# EAGLE design Qwiic_GPIO (EAGLE 9.4.2)
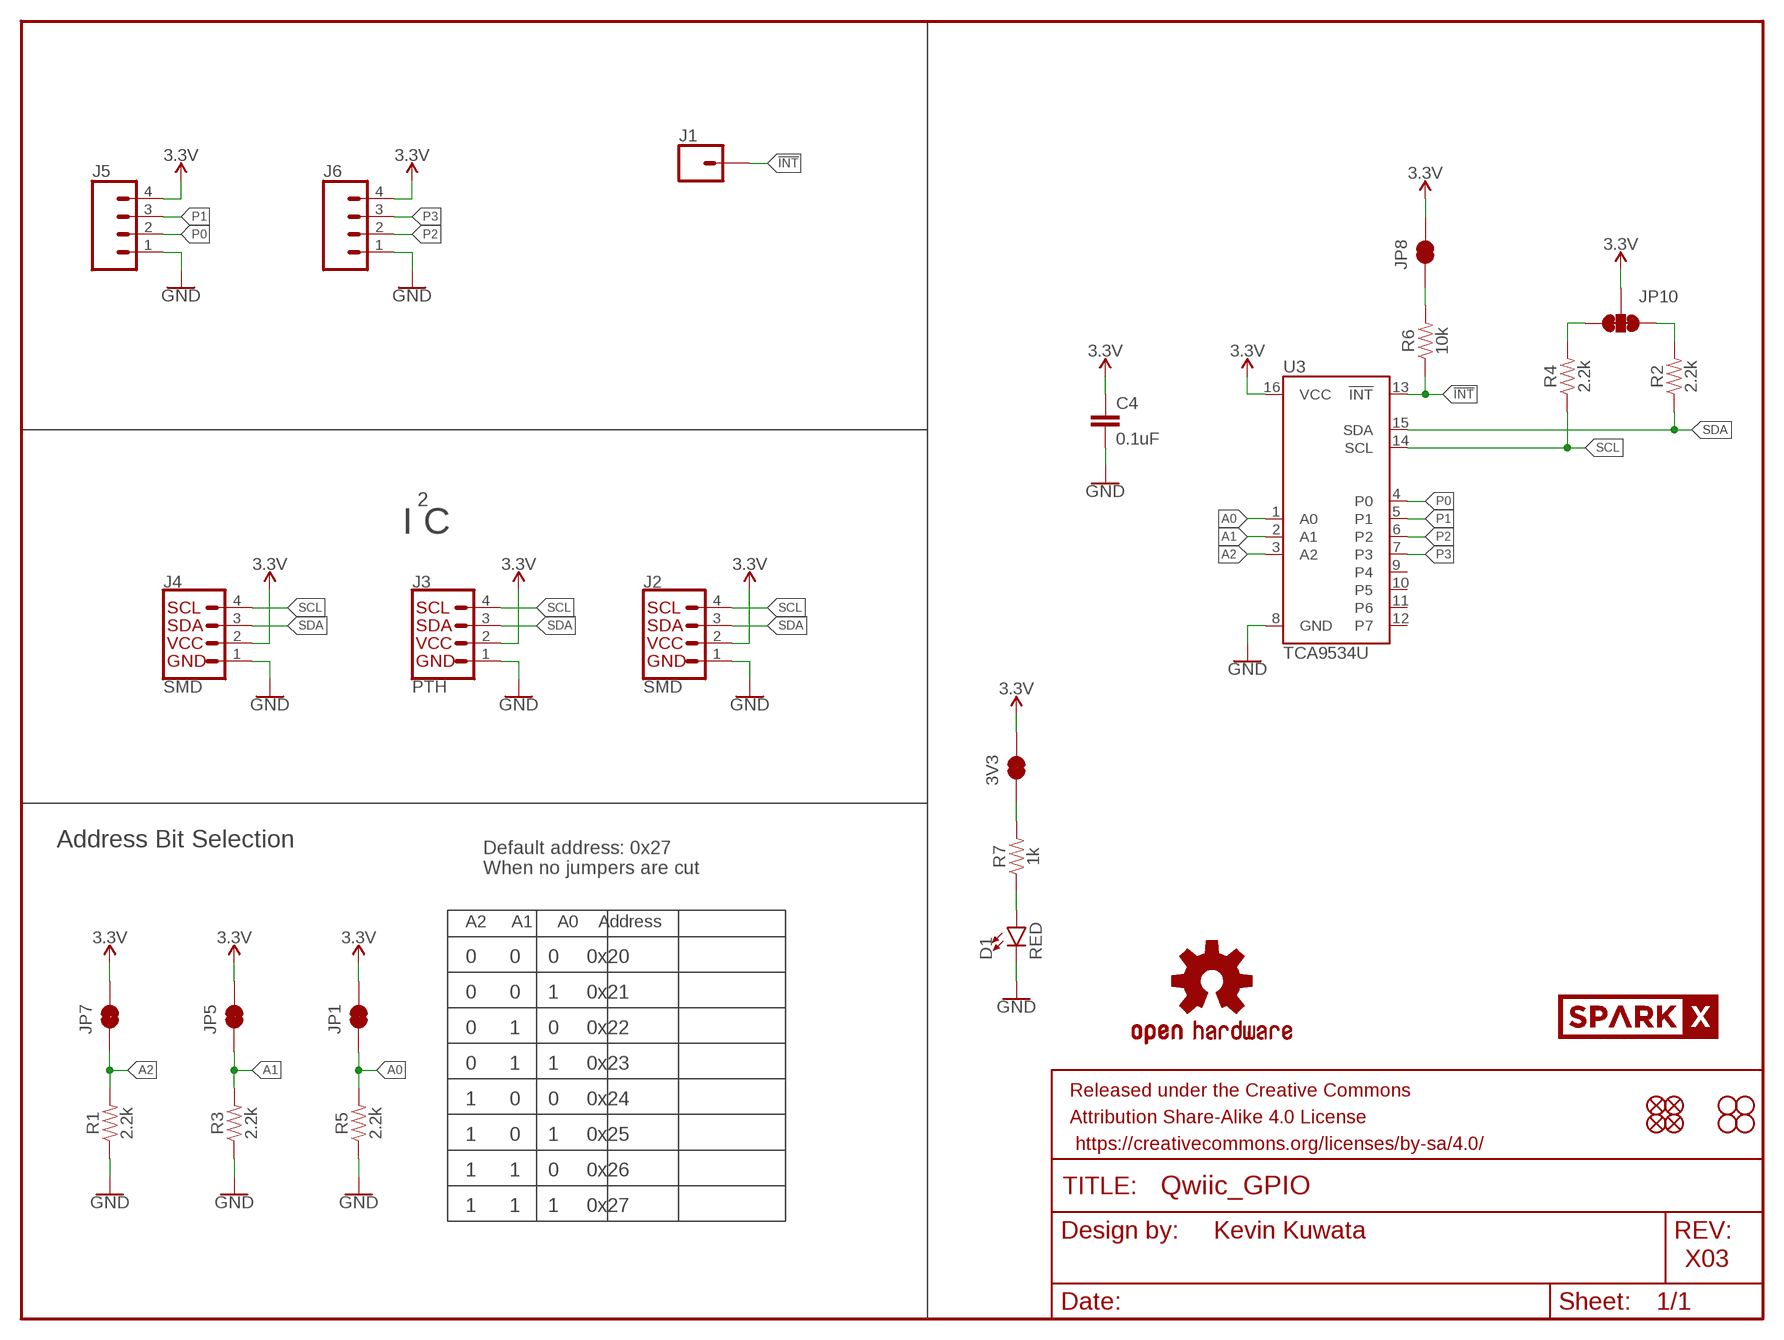
[diagram p0: schematic, sheet 1]

## Parts
3V3  JUMPER-SMT_2_NC_TRACE_SILK  [SMT-JUMPER_2_NC_TRACE_SILK]
C4  0.1uF  0.1UF-0603-25V-(+80/-20%)  [0603]
D1  RED  LED-RED0603  [LED-0603]
FD1  FIDUCIAL1X2  [FIDUCIAL-1X2]
FD2  FIDUCIAL1X2  [FIDUCIAL-1X2]
FRAME1  FRAME-LETTER  [CREATIVE_COMMONS]
H1  STAND-OFF  [STAND-OFF]
H2  STAND-OFF  [STAND-OFF]
J1  CONN_01PTH_NO_SILK_YES_STOP  [1X01_NO_SILK]
J2  SMD  I2C_STANDARDJS-1MM  [1X04_1MM_RA]
J3  PTH  I2C_STANDARD_NO_SILK  [1X04_NO_SILK]
J4  SMD  I2C_STANDARDJS-1MM  [1X04_1MM_RA]
J5  CONN_04LATCH  [LATCHTERMINAL-5MM-4]
J6  CONN_04LATCH  [LATCHTERMINAL-5MM-4]
JP1  JUMPER-SMT_2_NC_TRACE_SILK  [SMT-JUMPER_2_NC_TRACE_SILK]
JP2  FIDUCIAL1X2  [FIDUCIAL-1X2]
JP3  STAND-OFF  [STAND-OFF]
JP4  STAND-OFF  [STAND-OFF]
JP5  JUMPER-SMT_2_NC_TRACE_SILK  [SMT-JUMPER_2_NC_TRACE_SILK]
JP6  FIDUCIAL1X2  [FIDUCIAL-1X2]
JP7  JUMPER-SMT_2_NC_TRACE_SILK  [SMT-JUMPER_2_NC_TRACE_SILK]
JP8  JUMPER-SMT_2_NC_TRACE_SILK  [SMT-JUMPER_2_NC_TRACE_SILK]
JP10  JUMPER-SMT_3_2-NC_TRACE_SILK  [SMT-JUMPER_3_2-NC_TRACE_SILK]
LOGO1  OSHW-LOGOMINI  [OSHW-LOGO-MINI]
R1  2.2k  2.2KOHM-0603-1/10W-1%  [0603]
R2  2.2k  2.2KOHM-0603-1/10W-1%  [0603]
R3  2.2k  2.2KOHM-0603-1/10W-1%  [0603]
R4  2.2k  2.2KOHM-0603-1/10W-1%  [0603]
R5  2.2k  2.2KOHM-0603-1/10W-1%  [0603]
R6  10k  10KOHM-0603-1/10W-1%  [0603]
R7  1k  1KOHM-0603-1/10W-1%  [0603]
U3  TCA9534U  [16SOIC]
U$1  SPARKX-LOGO3  [SPARKX-SMALL]
U$2  SPARKX-LOGO3  [SPARKX-SMALL]

## Nets
3.3V: 3V3.2 C4.1 J2.2(VCC) J3.2(VCC) J4.2(VCC) J5.4 J6.4 JP1.2 JP5.2 JP7.2 JP8.2 JP10.2 U3.16(VCC)
!INT: J1.1 R6.1 U3.13(!INT)
A0: JP1.1 R5.2 U3.1(A0)
A1: JP5.1 R3.2 U3.2(A1)
A2: JP7.1 R1.2 U3.3(A2)
GND: C4.2 D1.C J2.1(GND) J3.1(GND) J4.1(GND) J5.1 J6.1 R1.1 R3.1 R5.1 U3.8(GND)
N$1: JP8.1 R6.2
N$2: D1.A R7.1
N$3: 3V3.1 R7.2
P0: J5.2 U3.4(P0)
P1: J5.3 U3.5(P1)
P2: J6.2 U3.6(P2)
P3: J6.3 U3.7(P3)
SCL: J2.4(SCL) J3.4(SCL) J4.4(SCL) R4.1 U3.14(SCL)
SCL_PU1: JP10.1 R2.2
SDA: J2.3(SDA) J3.3(SDA) J4.3(SDA) R2.1 U3.15(SDA)
SDA_PU1: JP10.3 R4.2
Unconnected: U3.9(P4) U3.10(P5) U3.11(P6) U3.12(P7)

## Notes on the sheet
- 2
- I C
- Address Bit Selection
- Default address: 0x27
  When no jumpers are cut
- A2     A1     A0    Address
- 0      0     0     0x20
- 0      0     1     0x21
- 0      1     0     0x22
- 0      1     1     0x23
- 1      0     0     0x24
- 1      0     1     0x25
- 1      1     0     0x26
- 1      1     1     0x27
- Kevin Kuwata
- X03

## Library data of the parts
3V3 JP1 JP5 JP7 JP8 = SparkFun-Jumpers:JUMPER-SMT_2_NC_TRACE: Normally closed trace jumper This jumper has a trace between two pads so it's normally closed (NC). Use a razor knife to open the connection. For best results follow the IPC guidelines for cutting traces: Cutout at least 0.063 mm (0.005 in). Remove all loose material to clean up the cut area. Seal the cut with an approved epoxy. Reapply solder to reclose the connection.
C4 = SparkFun-Capacitors:0.1UF: 0.1µF ceramic capacitors A capacitor is a passive two-terminal electrical component used to store electrical energy temporarily in an electric field.; PROD_ID: CAP-00810
D1 = SparkFun-LED:LED-RED: Red SMD LED Used in manufacturing of most products at SparkFun Packages: 0603 - SMD 0603 package [Product Link] <http://docs.avagotech.com/docs/AV02-0551EN> 0603 SMART - SMD 0603 SMART package ( more efficient and expensive)[Product Link] <http://www.osram-os.com/Graphics/XPic2/00077099_0.pdf> 1206 - SMD1206 package [Product Link] <https://www.sparkfun.com/datasheets/DevTools/LilyPad/Q150OVS4.pdff> SparkFun Products: Pro Mini 328 -5V <https://www.sparkfun.com/products/821> RedBoard <https://www.sparkfun.com/products/12757> IOIO-OTG <https://www.sparkfun.com/products/13613>; PROD_ID: DIO-00819
FD1 FD2 = SparkFun-Aesthetics:FIDUCIAL: Fiducial Alignment Points
FRAME1 = SparkFun-Aesthetics:FRAME-LETTER: Schematic Frame - Letter Standard 8.5x11 US Letter frame
H1 H2 = SparkFun-Hardware:STAND-OFF: Stand Off
J1 = SparkFun-Connectors:CONN_01: Single connection point. Often used as Generic Header-pin footprint for 0.1 inch spaced/style header connections On any of the 0.1 inch spaced packages, you can populate with these: Break Away Headers - Straight <https://www.sparkfun.com/products/116> (PRT-00116) Break Away Male Headers - Right Angle <https://www.sparkfun.com/products/553> (PRT-00553) Female Headers <https://www.sparkfun.com/products/115> (PRT-00115) Break Away Headers - Machine Pin <https://www.sparkfun.com/products/117> (PRT-00117) Break Away Female Headers - Swiss Machine Pin <https://www.sparkfun.com/products/743> (PRT-00743) This device is also useful as a general connection point to wire up your design to another part of your project. Our various solder wires solder well into these plated through hole pads. Hook-Up Wire - Assortment (Stranded, 22 AWG) <https://www.sparkfun.com/products/11375> (PRT-11375) Hook-Up Wire - Assortment (Solid Core, 22 AWG) <https://www.sparkfun.com/products/11367> (PRT-11367) View the entire wire category on our website here <https://www.sparkfun.com/categories/141> Special notes: SMTSO-256-ET is a "flush mount" nut for a 4-40 screw. We mostly use this on specialty testbeds; it is a nice way to connect hardware to your PCB at an adjustable hieght. Also note, the SNAP packages are for using a snappable style connector. We sell a baggie of snaps and they are also used on two LilyPad designs: Snap Assortment - 30 pack (male and female) <https://www.sparkfun.com/products/11347> (DEV-11347) LilyPad Arduino SimpleSnap <https://www.sparkfun.com/products/10941> (DEV-10941) LilyPad SimpleSnap Protoboard <https://www.sparkfun.com/products/10940> (DEV-10940)
J2 J4 = SparkX:I2C_STANDARD: SparkFun I2C Standard Pinout Header SparkFun has standardized on a pinout for all I2C based sensor breakouts. This pinout allows I2C boards to be plugged directly into the headers on Arduino Uno compatible boards, and to be daisy chained easily. Example SparkFun Products: SparkFun Atmospheric Sensor Breakout - BME280 <https://www.sparkfun.com/products/13676> SparkFun Altitude/Pressure Sensor Breakout - MPL3115A2 <https://www.sparkfun.com/products/11084> SparkFun TOF Range Finder Sensor - VL6180 <https://www.sparkfun.com/products/12785>; PROD_ID: CONN-13694
J3 = SparkX:I2C_STANDARD: SparkFun I2C Standard Pinout Header SparkFun has standardized on a pinout for all I2C based sensor breakouts. This pinout allows I2C boards to be plugged directly into the headers on Arduino Uno compatible boards, and to be daisy chained easily. Example SparkFun Products: SparkFun Atmospheric Sensor Breakout - BME280 <https://www.sparkfun.com/products/13676> SparkFun Altitude/Pressure Sensor Breakout - MPL3115A2 <https://www.sparkfun.com/products/11084> SparkFun TOF Range Finder Sensor - VL6180 <https://www.sparkfun.com/products/12785>
J5 J6 = SparkFun-Connectors:CONN_04: Multi connection point. Often used as Generic Header-pin footprint for 0.1 inch spaced/style header connections On any of the 0.1 inch spaced packages, you can populate with these: Break Away Headers - Straight <https://www.sparkfun.com/products/116> (PRT-00116) Break Away Male Headers - Right Angle <https://www.sparkfun.com/products/553> (PRT-00553) Female Headers <https://www.sparkfun.com/products/115> (PRT-00115) Break Away Headers - Machine Pin <https://www.sparkfun.com/products/117> (PRT-00117) Break Away Female Headers - Swiss Machine Pin <https://www.sparkfun.com/products/743> (PRT-00743) For SCREWTERMINALS and SPRING TERMINALS visit here: Screw Terimnals on SparkFun.com <https://www.sparkfun.com/search/results?term=Screw+Terminals> (5mm/3.5mm/2.54mm spacing) This device is also useful as a general connection point to wire up your design to another part of your project. Our various solder wires solder well into these plated through hole pads. Hook-Up Wire - Assortment (Stranded, 22 AWG) <https://www.sparkfun.com/products/11375> (PRT-11375) Hook-Up Wire - Assortment (Solid Core, 22 AWG) <https://www.sparkfun.com/products/11367> (PRT-11367) View the entire wire category on our website here <https://www.sparkfun.com/categories/141> Special notes: Molex polarized connector foot print use with SKU : PRT-08231 with associated crimp pins and housings. 1MM SMD Version SKU: PRT-10208; PROD_ID: CON-14722
JP2 JP6 = SparkFun:FIDUCIAL: Fiducial Alignment Points
JP3 JP4 = SparkFun:STAND-OFF: Stand Off
JP10 = SparkFun-Jumpers:JUMPER-SMT_3_2-NC_TRACE: Normally closed trace jumper (2 of 2 connections) This jumper has a trace between all three pads so they are normally closed (NC). Use a razor knife to open the connection(s). For best results follow the IPC guidelines for cutting traces: Cutout at least 0.063 mm (0.005 in). Remove all loose material to clean up the cut area. Seal the cut with an approved epoxy. Reapply solder to reclose the connection(s).
LOGO1 = SparkFun-Aesthetics:OSHW-LOGO: Open-Source Hardware (OSHW) Logo This logo indicates the piece of hardware it is found on incorporates a OSHW license and/or adheres to the definition of open source hardware found here: http://freedomdefined.org/OSHW
R1-R5 = SparkFun-Resistors:2.2KOHM: 2.2kΩ resistor A resistor is a passive two-terminal electrical component that implements electrical resistance as a circuit element. Resistors act to reduce current flow, and, at the same time, act to lower voltage levels within circuits. - Wikipedia; PROD_ID: RES-08272
R6 = SparkFun-Resistors:10KOHM: 10kΩ resistor A resistor is a passive two-terminal electrical component that implements electrical resistance as a circuit element. Resistors act to reduce current flow, and, at the same time, act to lower voltage levels within circuits. - Wikipedia; PROD_ID: RES-00824
R7 = SparkFun-Resistors:1KOHM: 1kΩ resistor A resistor is a passive two-terminal electrical component that implements electrical resistance as a circuit element. Resistors act to reduce current flow, and, at the same time, act to lower voltage levels within circuits. - Wikipedia; PROD_ID: RES-07856
U3 = KevinKuwata_eagle:TCA9534
U$1 U$2 = SparkX:SPARKX-LOGO

## Board
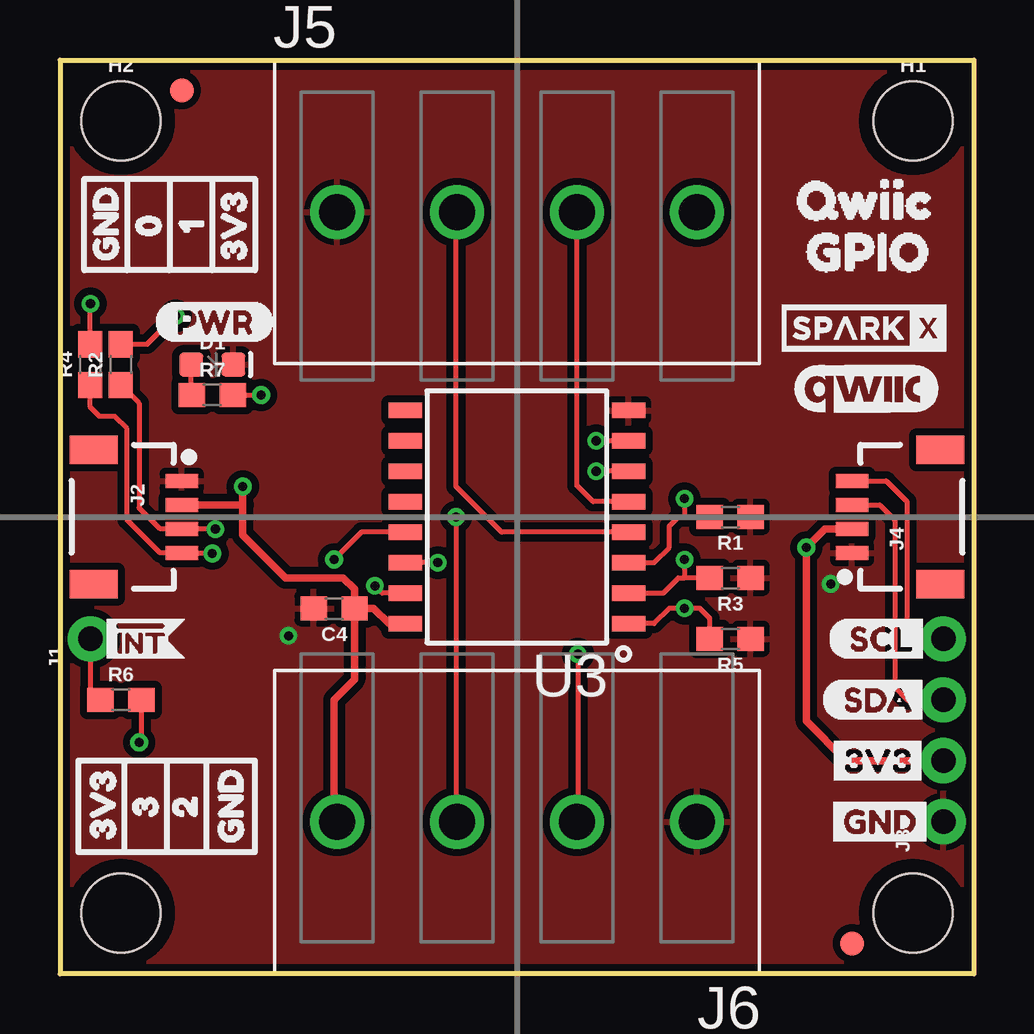
[diagram p1: board, top side]
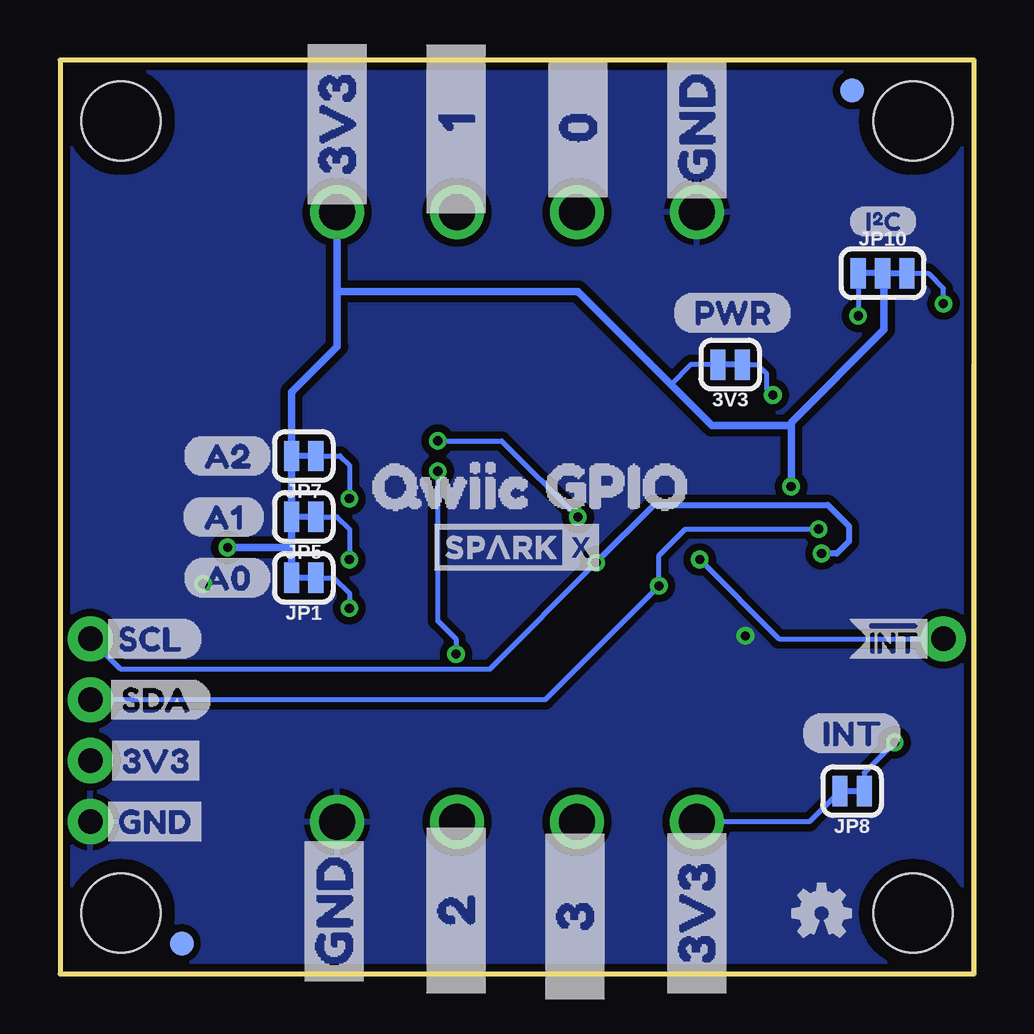
[diagram p2: board, bottom side, seen from below]

Size 38.1 x 38.1 mm. Coordinates in mm from the lower left corner, seen from the top.
Outline: 0,38.1 38.1,38.1 38.1,0 0,0 0,38.1
Copper layers (1*16): Top 0.035mm / dielectric 1.5mm / Bottom 0.035mm
Design rules "SparkFun-2-layer-PCBWay-LIMIT": minimum track width 6mil, minimum drill 12mil, track to track 6mil, track to pad 6mil, pad to pad 6mil, via to via 6mil, smd to smd 6mil, copper to edge 6mil, drill to drill 6mil, minimum pad ring 7mil, minimum via ring 7mil, stop-mask expansion 4mil, vias tented up to drill 25mil, thermal gap 10mil

### Footprints (pad centres in the part's own frame; a part is rotated, then mirrored left to right if it is on the bottom)
SMT-JUMPER_2_NC_TRACE_SILK = smd 0.635 x 1.27: 1 -0.508,0; 2 0.508,0
0603 = smd 1.1 x 1: 1 -0.85,0; 2 0.85,0
LED-0603 = smd 1 x 1: A -0.877,0; C 0.877,0
FIDUCIAL-1X2 = smd 1 x 1: 1 0,0
STAND-OFF = hole 3.302: 0,0
1X01_NO_SILK = drill 1.016 pad 1.88: 1 0,0
1X04_1MM_RA = smd 0.6 x 1.35: 1 -1.5,0; 2 -0.5,0; 3 0.5,0; 4 1.5,0 | smd 1.2 x 2: NC1 2.8,-3.675; NC2 -2.8,-3.675
1X04_NO_SILK = drill 1.016 pad 1.88: 1 0,0; 2 2.54,0; 3 5.08,0; 4 7.62,0
LATCHTERMINAL-5MM-4 = drill 1.5: 1 -7.5,0; 2 -2.5,0; 3 2.5,0; 4 7.5,0
SMT-JUMPER_3_2-NC_TRACE_SILK = smd 0.635 x 1.27: 1 -1.016,0; 2 0,0; 3 1.016,0
16SOIC = smd 1.397 x 0.648: 1 -4.65,4.445; 2 -4.65,3.175; 3 -4.65,1.905; 4 -4.65,0.635; 5 -4.65,-0.635; 6 -4.65,-1.905; 7 -4.65,-3.175; 8 -4.65,-4.445; 9 4.65,-4.445; 10 4.65,-3.175; 11 4.65,-1.905; 12 4.65,-0.635; 13 4.65,0.635; 14 4.65,1.905; 15 4.65,3.175; 16 4.65,4.445

### Placement (x,y rotation side)
3V3  10.16,25.4 180 bottom
C4  11.43,15.24 180 top
D1  6.35,25.4 0 top
FD1  5.08,36.83 0 bottom
FD2  33.02,1.27 270 bottom
FRAME1  -16.51,-49.53 0 top  (outside the outline)
H1  35.56,35.56 0 top
H2  2.54,35.56 0 top
J1  1.27,13.97 90 top
J2  5.08,19.05 270 top
J3  36.83,6.35 90 top
J4  33.02,19.05 90 top
J5  19.05,31.75 0 top
J6  19.05,6.35 180 top
JP1  27.94,16.51 180 bottom
JP2  33.02,1.27 0 top
JP3  2.54,2.54 0 top
JP4  35.56,2.54 0 top
JP5  27.94,19.05 180 bottom
JP6  5.08,36.83 0 top
JP7  27.94,21.59 180 bottom
JP8  5.08,7.62 180 bottom
JP10  3.81,29.21 0 bottom
LOGO1  6.35,2.54 0 bottom
R1  27.94,19.05 180 top
R2  2.54,25.4 90 top
R3  27.94,16.51 180 top
R4  1.27,25.4 90 top
R5  27.94,13.97 180 top
R6  2.54,11.43 0 top
R7  6.35,24.13 0 top
U3  19.05,19.05 180 top
U$1  19.05,17.78 0 bottom
U$2  33.53,26.92 0 top
U$3  [3V33]  31.75,8.89 0 top
U$5  [A11]  33.02,19.05 0 bottom
U$7  [GND4]  31.75,6.35 0 top
U$8  [QWIIC_GPIO7]  26.67,20.32 0 bottom
U$9  [SCL6]  32,13.97 0 top
U$10  [SDA5]  31.75,11.43 0 top
U$11  [A00]  33.02,16.51 0 bottom
U$12  [A21]  33.02,21.59 0 bottom
U$13  [#INT0]  1.27,13.97 0 top
U$20  [I_SUPER2_C-()-03]  5.21,31.37 0 bottom
U$21  [QWIIC_6MM]  33.66,24.38 0 top
U$22  [#INT0]  5.46,13.97 0 bottom
U$23  [SCL0]  36.58,13.97 0 bottom
U$24  [SDA1]  36.45,11.43 0 bottom
U$25  [GND4]  36.58,6.35 0 bottom
U$26  [3V33]  36.45,8.89 0 bottom
U$27  [3V32]  1.78,4.7 90 top
U$28  [GND1]  7.11,4.57 90 top
U$29  [15]  5.46,29.97 90 top
U$30  [INT1]  7.24,10.03 0 bottom
U$31  [INT1]  7.24,10.03 0 bottom
U$32  [QWIIC1]  29.34,32.26 0 top
U$33  [20]  5.21,5.46 90 top
U$34  [31]  3.56,5.46 90 top
U$35  [GND2]  1.91,28.83 90 top
U$36  [GPIO1]  29.72,30.1 0 top
U$37  [04]  3.68,29.84 90 top
U$38  [3V33]  7.24,28.83 90 top
U$39  [PWR0]  3.94,27.18 0 top
U$40  [PWR0]  12.57,27.56 0 bottom
U$41  [____0____1]  16.51,31.11 90 bottom
U$42  [____2____3]  21.59,-1.52 90 bottom
U$43  [____3____4]  16.64,-1.78 90 bottom
U$44  [_____1____2]  21.59,30.99 90 bottom
U$45  [GND0]  26.67,-1.02 90 bottom
U$46  [GND0]  11.56,31.62 90 bottom
U$47  [_3V3_0]  26.54,31.37 90 bottom
U$48  [_3V3_0]  11.56,-1.52 90 bottom

### Tracks (layer width: path | path; a pad name or v marks a point on that pad's centre or on a via)
3.3V  (via drill 0.38)
  Top 0.305: 7.62,19.55 J2.2 | 7.62,19.55 v7.62,20.32 | J4.2 31.89,18.55 v31.11,17.78 31.11,10.54 32.77,8.89 J3.2 | C4.1 12.28,12.28 11.43,11.43 11.43,6.47 J6.4 | C4.1 12.28,16.04 11.81,16.51 9.4,16.51 7.62,18.29 7.62,19.55 | U3.16 13.72,14.61 13.08,15.24 C4.1
  Bottom 0.203: 7.62,22.86 7.62,22.99 | JP10.2 3.75,29.15 | 26.54,28.45 26.55,28.45 | JP8.2 6.86,6.35 J6.4 | 3V3.2 11.81,25.4 12.64,24.57
  Bottom 0.305: v7.62,20.32 7.62,22.86 10.92,22.86 12.64,24.57 16.51,28.45 26.54,28.45 26.54,26.16 28.45,24.26 JP7.2 JP5.2 28.45,17.78 | 7.62,22.99 3.75,26.86 3.75,29.15 | 26.55,28.45 J5.4 | 28.45,17.78 v31.11,17.78 | JP1.2 28.45,17.78
!INT  (via drill 0.38)
  Top 0.203: U3.13 12.57,18.41 v11.43,17.27 | J1.1 1.27,11.85 R6.1
  Bottom 0.203: J1.1 8.13,13.97 v11.43,17.27
A0  (via drill 0.38)
  Top 0.203: R5.2 27.09,14.82 26.67,15.24 v26.04,15.24 25.4,15.24 24.77,14.61 U3.1
  Bottom 0.203: v26.04,15.24 26.04,15.88 26.67,16.51 JP1.1
A1  (via drill 0.38)
  Top 0.203: U3.2 25.15,15.88 25.78,16.51 26.04,16.51 | v26.04,17.27 26.04,16.51 | R3.2 26.04,16.51
  Bottom 0.203: v26.04,17.27 26.04,18.54 26.54,19.05 JP5.1
A2  (via drill 0.38)
  Top 0.203: U3.3 24.77,17.14 25.4,17.78 25.4,18.67 25.78,19.05 26.04,19.05 | 26.04,19.05 R1.2 | v26.04,19.81 26.04,19.05
  Bottom 0.203: v26.04,19.81 26.04,21.21 26.42,21.59 JP7.1
GND  (via drill 0.38)
  other vias: 32.13,16.26 9.53,14.1
  pour Top (isolate 0.305): 0,38.1 38.1,38.1 38.1,0 0,0
  pour Bottom (isolate 0.305): 0,38.1 38.1,38.1 38.1,0 0,0
N$1  (via drill 0.38)
  Top 0.203: R6.2 3.39,9.74 v3.3,9.65
  Bottom 0.203: JP8.1 4.57,8.38 v3.3,9.65
N$2
  Top 0.203: R7.1 5.47,24.16 D1.A
N$3  (via drill 0.38)
  Top 0.203: R7.2 v8.38,24.13
  Bottom 0.203: v8.38,24.13 8.64,24.38 8.64,25.02 9.02,25.4 3V3.1
P0
  Top 0.203: U3.4 18.41,18.41 16.51,20.32 16.51,31.71 J5.2
P1
  Top 0.203: U3.5 22.23,19.68 21.55,20.36 J5.3
P2  (via drill 0.38)
  Top 0.203: U3.6 v22.35,20.95 | v21.59,13.34 21.59,6.39 J6.2
  Bottom 0.203: v22.35,20.95 22.35,14.73 21.59,13.97 v21.59,13.34
P3  (via drill 0.38)
  Top 0.203: U3.7 v22.35,22.23 | v16.51,19.05 16.51,6.39 J6.3
  Bottom 0.203: v22.35,22.23 19.68,22.23 v16.51,19.05
SCL  (via drill 0.38)
  Top 0.203: R4.1 1.27,23.62 1.65,23.24 2.29,23.24 2.79,22.73 2.79,18.92 4.17,17.55 J2.4 5.1,17.53 v6.35,17.53 | J4.4 34.44,20.55 35.31,19.68 35.31,14.35 35.69,13.97 J3.4 | v15.75,17.14 U3.14
  Bottom 0.203: v15.75,17.14 20.19,12.7 35.56,12.7 J3.4
  Bottom 0.254: v15.75,17.14 13.34,19.56 6.1,19.56 5.21,18.67 5.21,18.03 5.71,17.53 v6.35,17.53
SCL_PU1  (via drill 0.38)
  Top 0.203: R2.2 3.64,26.25 v4.83,27.43
  Bottom 0.203: JP10.1 v4.83,27.43
SDA  (via drill 0.38)
  Top 0.203: R2.1 3.3,23.79 3.3,19.43 4.18,18.55 J2.3 v6.48,18.54 | U3.15 13.43,15.88 v13.13,16.18 | J4.3 34.17,19.55 34.8,18.92 34.8,11.94 35.31,11.43 J3.3
  Bottom 0.203: v6.48,18.54 12.03,18.54 13.13,17.45 v13.13,16.18 17.88,11.43 J3.3
SDA_PU1  (via drill 0.38)
  Top 0.203: R4.2 v1.27,27.94
  Bottom 0.203: v1.27,27.94 1.27,28.57 1.91,29.21 JP10.3

### Text on the board
tDocu: Kevin Kuwata